# Altium schematic sheet AD9363_Control.SchDoc
size A4
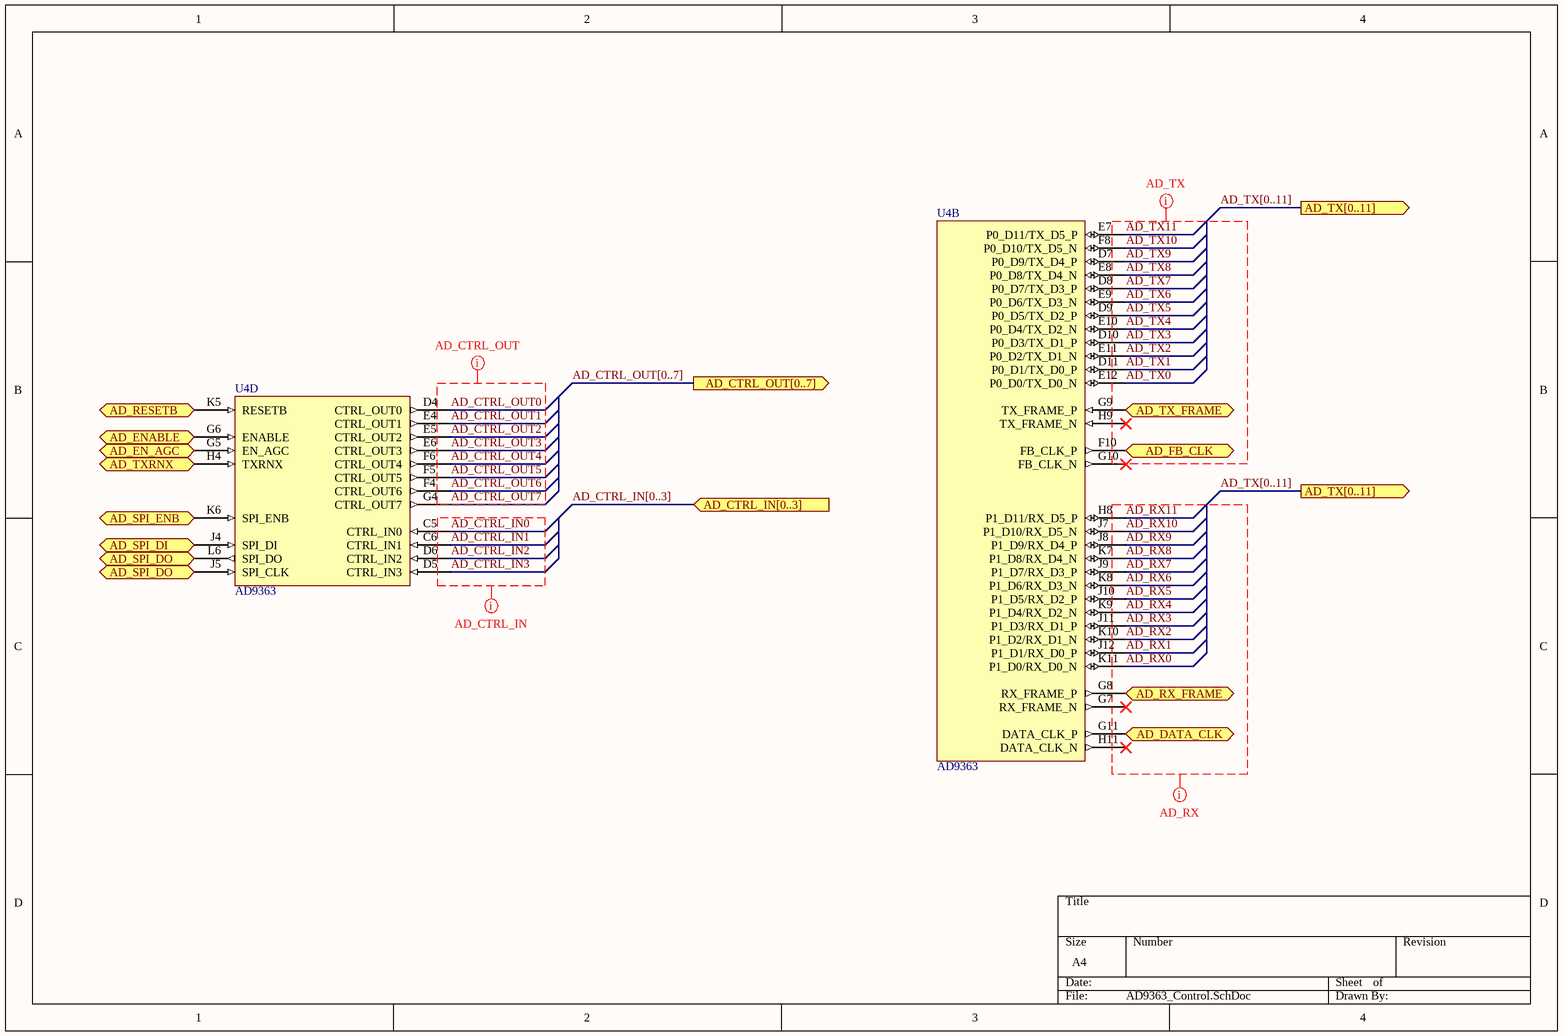
[diagram p0: AD9363_Control.SchDoc]

## Parts
U4  AD9363  (parts B,D of 5)

## Ports
AD_CTRL_IN[0..3] (in), AD_CTRL_OUT[0..7] (out), AD_DATA_CLK (out), AD_EN_AGC (in), AD_ENABLE (in), AD_FB_CLK (out), AD_RESETB (in), AD_RX_FRAME (out), AD_SPI_DI (in), AD_SPI_DO (in), AD_SPI_DO (out), AD_SPI_ENB (in), AD_TX[0..11] (out), AD_TX_FRAME (in), AD_TXRNX (in)

## Nets
AD_CTRL_IN0: U4.C5(CTRL_IN0)
AD_CTRL_IN1: U4.C6(CTRL_IN1)
AD_CTRL_IN2: U4.D6(CTRL_IN2)
AD_CTRL_IN3: U4.D5(CTRL_IN3)
AD_CTRL_OUT0: U4.D4(CTRL_OUT0)
AD_CTRL_OUT1: U4.E4(CTRL_OUT1)
AD_CTRL_OUT2: U4.E5(CTRL_OUT2)
AD_CTRL_OUT3: U4.E6(CTRL_OUT3)
AD_CTRL_OUT4: U4.F6(CTRL_OUT4)
AD_CTRL_OUT5: U4.F5(CTRL_OUT5)
AD_CTRL_OUT6: U4.F4(CTRL_OUT6)
AD_CTRL_OUT7: U4.G4(CTRL_OUT7)
AD_DATA_CLK: U4.G11(DATA_CLK_P) ; port AD_DATA_CLK
AD_EN_AGC: U4.G5(EN_AGC) ; port AD_EN_AGC
AD_ENABLE: U4.G6(ENABLE) ; port AD_ENABLE
AD_FB_CLK: U4.F10(FB_CLK_P) ; port AD_FB_CLK
AD_RESETB: U4.K5(RESETB) ; port AD_RESETB
AD_RX0: U4.K11(P1_D0/RX_D0_N)
AD_RX1: U4.J12(P1_D1/RX_D0_P)
AD_RX2: U4.K10(P1_D2/RX_D1_N)
AD_RX3: U4.J11(P1_D3/RX_D1_P)
AD_RX4: U4.K9(P1_D4/RX_D2_N)
AD_RX5: U4.J10(P1_D5/RX_D2_P)
AD_RX6: U4.K8(P1_D6/RX_D3_N)
AD_RX7: U4.J9(P1_D7/RX_D3_P)
AD_RX8: U4.K7(P1_D8/RX_D4_N)
AD_RX9: U4.J8(P1_D9/RX_D4_P)
AD_RX10: U4.J7(P1_D10/RX_D5_N)
AD_RX11: U4.H8(P1_D11/RX_D5_P)
AD_RX_FRAME: U4.G8(RX_FRAME_P) ; port AD_RX_FRAME
AD_SPI_DI: U4.J4(SPI_DI) ; port AD_SPI_DI
AD_SPI_DO: U4.J5(SPI_CLK) U4.L6(SPI_DO) ; port AD_SPI_DO
AD_SPI_ENB: U4.K6(SPI_ENB) ; port AD_SPI_ENB
AD_TX0: U4.E12(P0_D0/TX_D0_N)
AD_TX1: U4.D11(P0_D1/TX_D0_P)
AD_TX2: U4.E11(P0_D2/TX_D1_N)
AD_TX3: U4.D10(P0_D3/TX_D1_P)
AD_TX4: U4.E10(P0_D4/TX_D2_N)
AD_TX5: U4.D9(P0_D5/TX_D2_P)
AD_TX6: U4.E9(P0_D6/TX_D3_N)
AD_TX7: U4.D8(P0_D7/TX_D3_P)
AD_TX8: U4.E8(P0_D8/TX_D4_N)
AD_TX9: U4.D7(P0_D9/TX_D4_P)
AD_TX10: U4.F8(P0_D10/TX_D5_N)
AD_TX11: U4.E7(P0_D11/TX_D5_P)
AD_TX_FRAME: U4.G9(TX_FRAME_P) ; port AD_TX_FRAME
AD_TXRNX: U4.H4(TXRNX) ; port AD_TXRNX

Not connected (* = marked no-connect by the designer): U4 G7(RX_FRAME_N)* G10(FB_CLK_N)* H9(TX_FRAME_N)* H11(DATA_CLK_N)*

## Buses and harness runs
bus AD_CTRL_IN[0..3] = port AD_CTRL_IN[0..3]
bus AD_CTRL_OUT[0..7] = port AD_CTRL_OUT[0..7]
bus AD_TX[0..11] = port AD_TX[0..11]

## Layout directives
net class Undefined: AD_CTRL_IN0, AD_CTRL_IN1, AD_CTRL_IN2, AD_CTRL_IN3, AD_CTRL_OUT0, AD_CTRL_OUT1, AD_CTRL_OUT2, AD_CTRL_OUT3, AD_CTRL_OUT4, AD_CTRL_OUT5, AD_CTRL_OUT6, AD_CTRL_OUT7, AD_RX0, AD_RX1, AD_RX2, AD_RX3, AD_RX4, AD_RX5, AD_RX6, AD_RX7, AD_RX8, AD_RX9, AD_RX10, AD_RX11, AD_TX0, AD_TX1, AD_TX2, AD_TX3, AD_TX4, AD_TX5, AD_TX6, AD_TX7, AD_TX8, AD_TX9, AD_TX10, AD_TX11